# Altium project 温控.PrjPCB
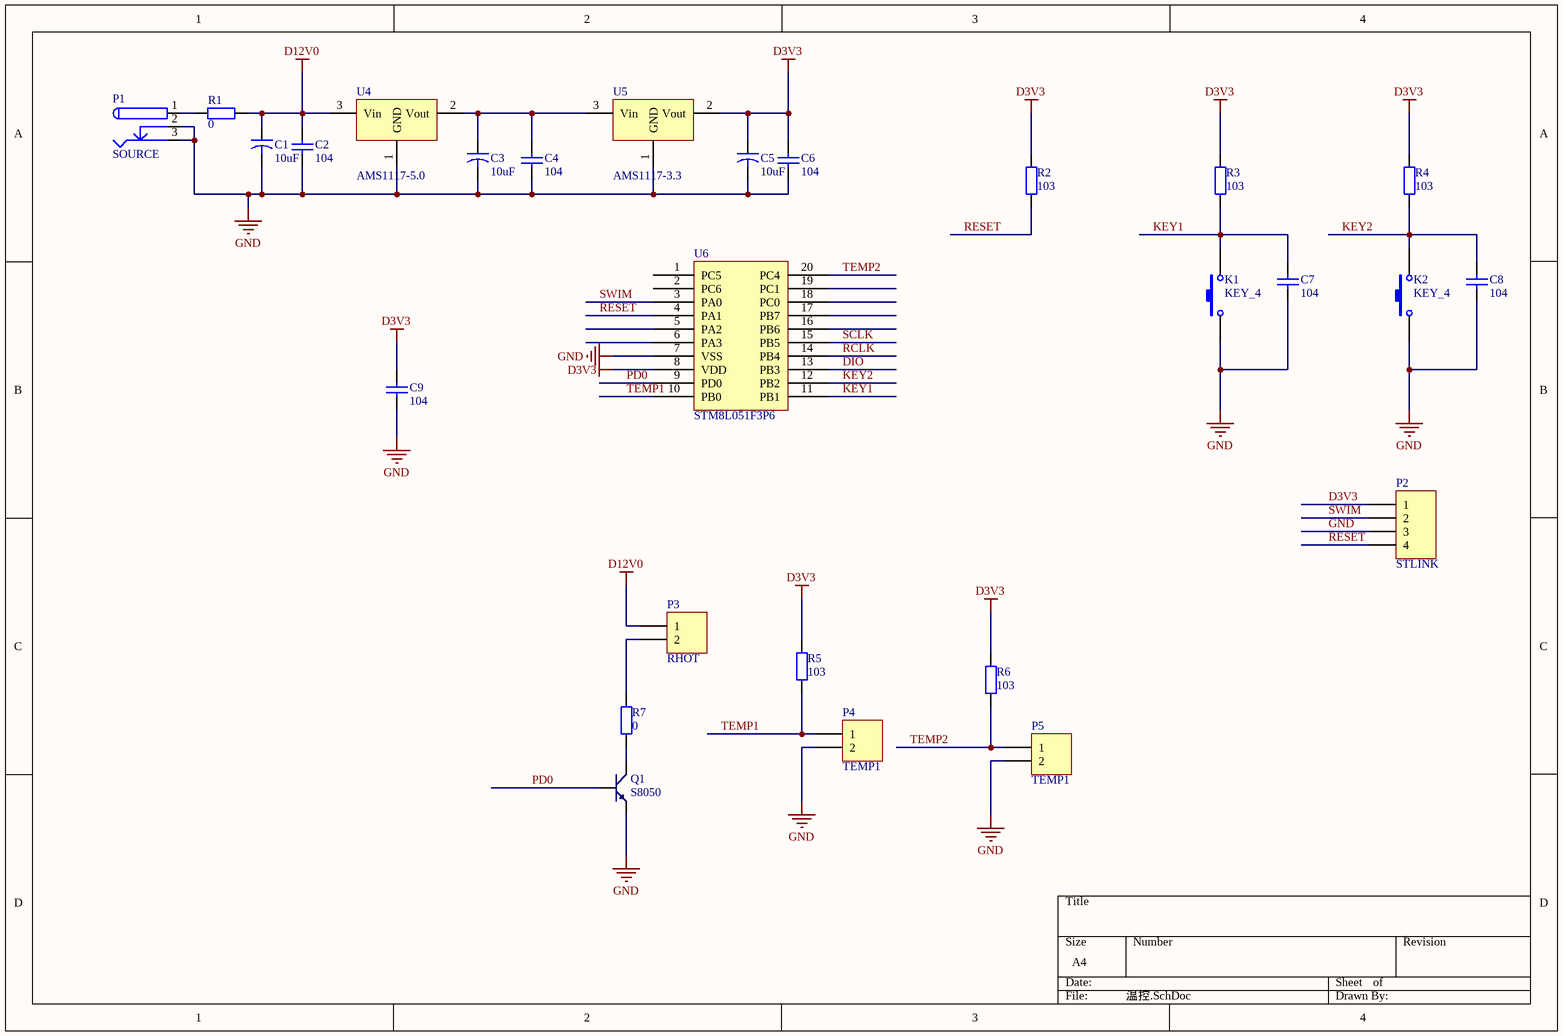
[diagram p0: 温控.SchDoc]
2 sheets, 30 parts. Net scope: global (net labels, ports and power ports of the same name join across sheets).
Board file: 温控.PcbDoc
Sheets:
  温控.SchDoc
  显示.SchDoc

## Sheet 温控.SchDoc
size A4

### Parts
C1  vaule: 10uF  [A_3216]  (hidden comment: CAP)
C2  value 104  [0603_cap]  (hidden comment: Cap)
C3  vaule: 10uF  [A_3216]  (hidden comment: CAP)
C4  value 104  [0603_cap]  (hidden comment: Cap)
C5  vaule: 10uF  [A_3216]  (hidden comment: CAP)
C6  value 104  [0603_cap]  (hidden comment: Cap)
C7  value 104  [0603_cap]  (hidden comment: Cap)
C8  value 104  [0603_cap]  (hidden comment: Cap)
C9  value 104  [0603_cap]  (hidden comment: Cap)
K1  KEY_4  [KEY6*6]
K2  KEY_4  [KEY6*6]
P1  SOURCE  [source]
P2  STLINK  [HDR1X4]
P3  RHOT  [HDR1X2]
P4  TEMP1  [HDR1X2]
P5  TEMP1  [HDR1X2]
Q1  S8050  [SOT-23R]
R1  0  [1206]
R2  103  [0603]
R3  103  [0603]
R4  103  [0603]
R5  103  [0603]
R6  103  [0603]
R7  0  [0603]
U4  AMS1117-5.0  [SOT223]
U5  AMS1117-3.3  [SOT223]
U6  STM8L051F3P6  [LC-TSSOP-20]

### Nets
D3V3: C5.1 C6.2 C9.2 P2.1 R2.2 R3.2 R4.2 R5.2 R6.2 U5.2(Vout) U6.8(VDD)
D12V0: C1.1 C2.2 P3.1 R1.2 U4.3(Vin)
GND: C1.2 C2.1 C3.2 C4.1 C5.2 C6.1 C7.1 C8.1 C9.1 K1.1 K2.1 P1.2 P1.3 P2.3 P4.2 P5.2 Q1.1(E) U4.1(GND) U5.1(GND) U6.7(VSS)
DIO: U6.13(PB3)
KEY1: C7.2 K1.2 R3.1 U6.11(PB1)
KEY2: C8.2 K2.2 R4.1 U6.12(PB2)
PD0: Q1.2(B) U6.9(PD0)
RCLK: U6.14(PB4)
RESET: P2.4 R2.1 U6.4(PA1)
SCLK: U6.15(PB5)
SWIM: P2.2 U6.3(PA0)
TEMP1: P4.1 R5.1 U6.10(PB0)
TEMP2: P5.1 R6.1 U6.20(PC4)
NetC3_1: C3.1 C4.2 U4.2(Vout) U5.3(Vin)
NetP1_1: P1.1 R1.1
NetP3_2: P3.2 R7.2
NetQ1_3: Q1.3(C) R7.1

Not connected (* = marked no-connect by the designer): U6 1(PC5) 2(PC6) 5(PA2) 6(PA3) 16(PB6) 17(PB7) 18(PC0) 19(PC1)

### Library data of the parts
C1 C3 C5 = CAP2
C2 C4 C6-C9 = Cap: Capacitor; Published: 8-Jun-2000; LatestRevisionDate: 17-Jul-2002; LatestRevisionNote: Re-released for DXP Platform.; PackageReference: RAD-0.3; Publisher: Altium Limited
K1 K2 = KEY_4: Switch; Published: 24-Mar-1999; LatestRevisionDate: 17-Jul-2002; LatestRevisionNote: Re-released for DXP Platform.; PackageReference: SPST-2; Publisher: Altium Limited
P2 = Header 4: Header, 4-Pin; LatestRevisionDate: 17-Jul-2002; LatestRevisionNote: Re-released for DXP Platform.; Publisher: Altium Limited
P3-P5 = Header 2: Header, 2-Pin; LatestRevisionDate: 17-Jul-2002; LatestRevisionNote: Re-released for DXP Platform.; Publisher: Altium Limited
Q1 = NPN: 8050/BCW846/BCW847
R1-R7 = RES: Resistor; Value: 1K; Published: 8-Jun-2000; Revision: July-2002: Re-released for DXP Platform.; Publisher: Altium Limited
U4 U5 = AMS1117: 3.3V电压转换器AMS1117
P1 = SOURCE: LatestRevisionDate: 17-Jul-2002; LatestRevisionNote: Re-released for DXP Platform.; Publisher: Altium Limited

## Sheet 显示.SchDoc
size A4
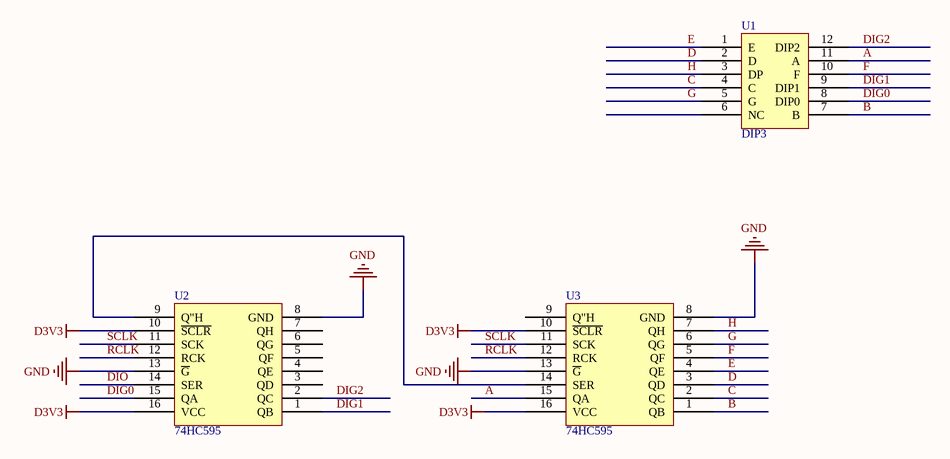
[diagram p1: 显示.SchDoc]

### Parts
U1  DIP3  [DIP3]
U2  74HC595  [LC-SOP-16_150mil]
U3  74HC595  [LC-SOP-16_150mil]

### Nets
D3V3: U2.10(~{SCLR}) U2.16(VCC) U3.10(~{SCLR}) U3.16(VCC)
GND: U2.8(GND) U2.13(~{G}) U3.8(GND) U3.13(~{G})
A: U1.11(A) U3.15(QA)
B: U1.7(B) U3.1(QB)
C: U1.4(C) U3.2(QC)
D: U1.2(D) U3.3(QD)
DIG0: U1.8(DIP0) U2.15(QA)
DIG1: U1.9(DIP1) U2.1(QB)
DIG2: U1.12(DIP2) U2.2(QC)
DIO: U2.14(SER)
E: U1.1(E) U3.4(QE)
F: U1.10(F) U3.5(QF)
G: U1.5(G) U3.6(QG)
H: U1.3(DP) U3.7(QH)
RCLK: U2.12(RCK) U3.12(RCK)
SCLK: U2.11(SCK) U3.11(SCK)
NetU2_9: U2.9(Q"H) U3.14(SER)

Not connected (* = marked no-connect by the designer): U1 6(NC); U2 3(QD) 4(QE) 5(QF) 6(QG) 7(QH); U3 9(Q"H)

## Nets that join several sheets
D3V3: 温控 (11 pins), 显示 (U2.10 U2.16 U3.10 U3.16)
GND: 温控 (20 pins), 显示 (U2.8 U2.13 U3.8 U3.13)
DIO: 温控 (U6.13), 显示 (U2.14)
RCLK: 温控 (U6.14), 显示 (U2.12 U3.12)
SCLK: 温控 (U6.15), 显示 (U2.11 U3.11)